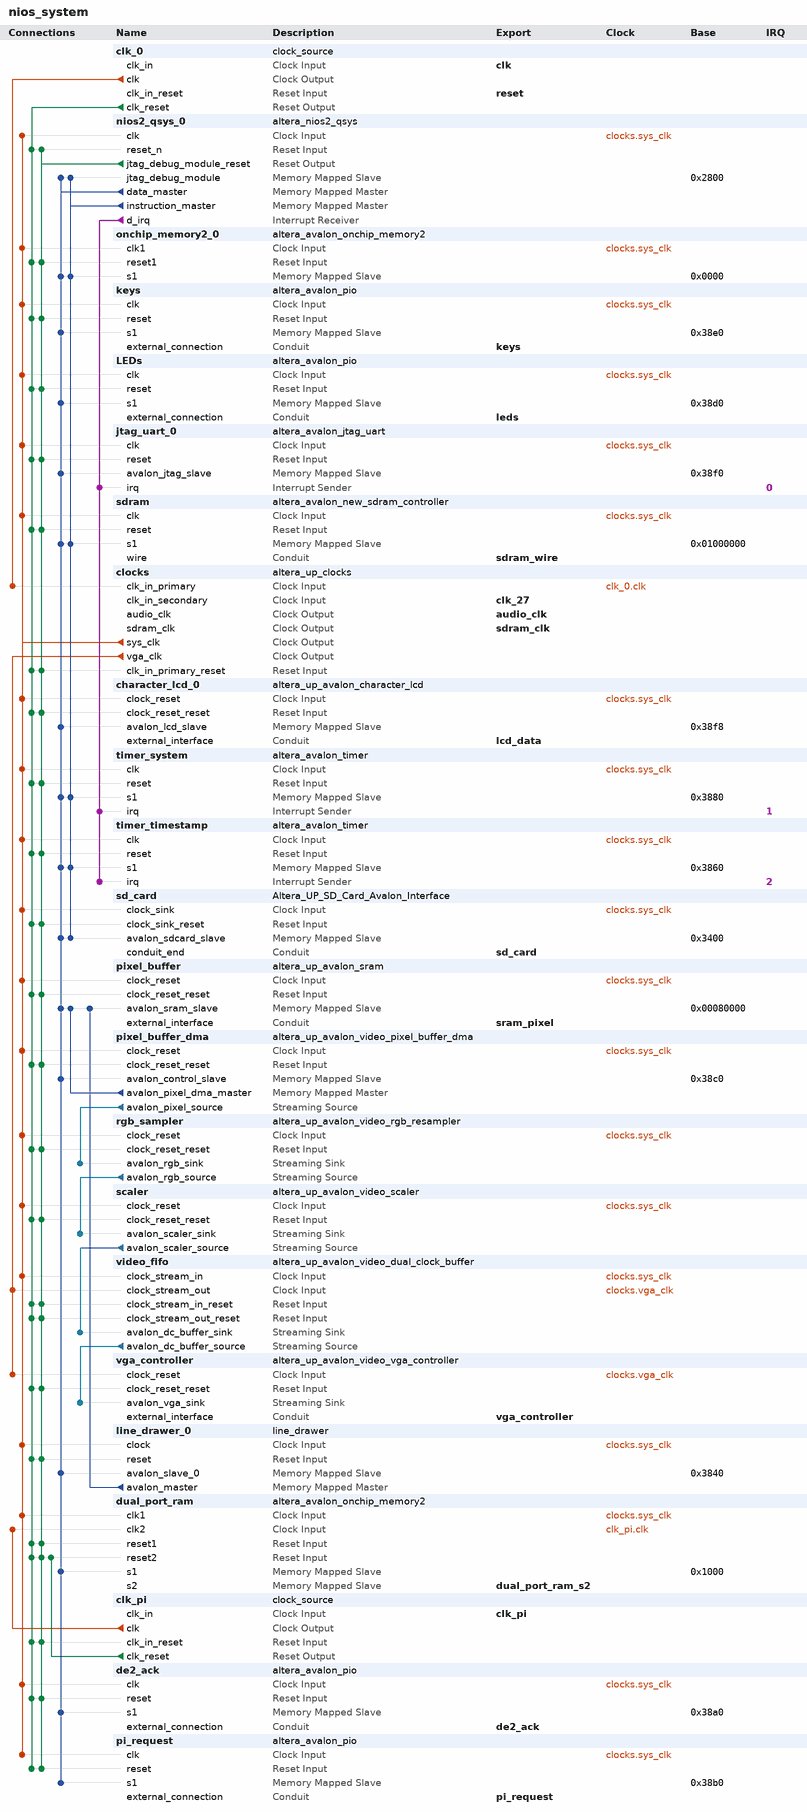
[diagram p0: system contents]
# Platform Designer (Qsys) system nios_system, Cyclone II EP2C35F672C6
# Parameters at their usual value, and those the tool derives, are not listed.
package require -exact qsys 13.0
create_system nios_system
set_project_property DEVICE_FAMILY {Cyclone II}
set_project_property DEVICE EP2C35F672C6

add_instance clk_0 clock_source 13.0
set_instance_parameter_value clk_0 clockFrequency 50000000

add_instance nios2_qsys_0 altera_nios2_qsys 13.0
set_instance_parameter_value nios2_qsys_0 muldiv_divider true
set_instance_parameter_value nios2_qsys_0 resetSlave sdram.s1
set_instance_parameter_value nios2_qsys_0 mmu_TLBMissExcSlave None
set_instance_parameter_value nios2_qsys_0 exceptionSlave sdram.s1
set_instance_parameter_value nios2_qsys_0 breakSlave nios2_qsys_0.jtag_debug_module
set_instance_parameter_value nios2_qsys_0 impl Tiny
set_instance_parameter_value nios2_qsys_0 icache_size 8192
set_instance_parameter_value nios2_qsys_0 dcache_bursts true
set_instance_parameter_value nios2_qsys_0 dcache_size 8192
set_instance_parameter_value nios2_qsys_0 dcache_lineSize 4

add_instance onchip_memory2_0 altera_avalon_onchip_memory2 13.0.1.99.2
set_instance_parameter_value onchip_memory2_0 dataWidth 32
set_instance_parameter_value onchip_memory2_0 dualPort false
set_instance_parameter_value onchip_memory2_0 initMemContent true
set_instance_parameter_value onchip_memory2_0 initializationFileName onchip_mem.hex
set_instance_parameter_value onchip_memory2_0 memorySize 4096

add_instance keys altera_avalon_pio 13.0.1.99.2
set_instance_parameter_value keys direction Input
set_instance_parameter_value keys width 4

add_instance LEDs altera_avalon_pio 13.0.1.99.2
set_instance_parameter_value LEDs direction Output
set_instance_parameter_value LEDs width 4

add_instance jtag_uart_0 altera_avalon_jtag_uart 13.0.1.99.2
set_instance_parameter_value jtag_uart_0 simInteractiveOptions NO_INTERACTIVE_WINDOWS

add_instance sdram altera_avalon_new_sdram_controller 13.0.1.99.2
set_instance_parameter_value sdram TAC 5.5
set_instance_parameter_value sdram TRCD 20.0
set_instance_parameter_value sdram TRP 20.0
set_instance_parameter_value sdram casLatency 3
set_instance_parameter_value sdram columnWidth 8
set_instance_parameter_value sdram dataWidth 16
set_instance_parameter_value sdram generateSimulationModel false
set_instance_parameter_value sdram model single_Micron_MT48LC4M32B2_7_chip
set_instance_parameter_value sdram numberOfBanks 4
set_instance_parameter_value sdram numberOfChipSelects 1
set_instance_parameter_value sdram powerUpDelay 100.0
set_instance_parameter_value sdram refreshPeriod 15.625
set_instance_parameter_value sdram rowWidth 12

add_instance clocks altera_up_clocks 13.0
set_instance_parameter_value clocks board DE2
set_instance_parameter_value clocks vga_clk true
set_instance_parameter_value clocks audio_clk true
set_instance_parameter_value clocks audio_clk_freq 12.288

add_instance character_lcd_0 altera_up_avalon_character_lcd 13.0
set_instance_parameter_value character_lcd_0 cursor Normal

add_instance timer_system altera_avalon_timer 13.0.1.99.2
set_instance_parameter_value timer_system period 1
set_instance_parameter_value timer_system periodUnits MSEC

add_instance timer_timestamp altera_avalon_timer 13.0.1.99.2
set_instance_parameter_value timer_timestamp period 1
set_instance_parameter_value timer_timestamp periodUnits MSEC

add_instance sd_card Altera_UP_SD_Card_Avalon_Interface 13.0

add_instance pixel_buffer altera_up_avalon_sram 13.0
set_instance_parameter_value pixel_buffer board DE2
set_instance_parameter_value pixel_buffer pixel_buffer true

add_instance pixel_buffer_dma altera_up_avalon_video_pixel_buffer_dma 13.0
set_instance_parameter_value pixel_buffer_dma addr_mode X-Y
set_instance_parameter_value pixel_buffer_dma start_address 0
set_instance_parameter_value pixel_buffer_dma back_start_address 0
set_instance_parameter_value pixel_buffer_dma image_width 320
set_instance_parameter_value pixel_buffer_dma image_height 240
set_instance_parameter_value pixel_buffer_dma color_space {16-bit RGB}

add_instance rgb_sampler altera_up_avalon_video_rgb_resampler 13.0
set_instance_parameter_value rgb_sampler input_type {16-bit RGB}
set_instance_parameter_value rgb_sampler output_type {30-bit RGB}
set_instance_parameter_value rgb_sampler alpha 1023

add_instance scaler altera_up_avalon_video_scaler 13.0
set_instance_parameter_value scaler width_scaling 2
set_instance_parameter_value scaler height_scaling 2
set_instance_parameter_value scaler width_in 320
set_instance_parameter_value scaler color_bits 10
set_instance_parameter_value scaler color_planes 3

add_instance video_fifo altera_up_avalon_video_dual_clock_buffer 13.0
set_instance_parameter_value video_fifo color_bits 10

add_instance vga_controller altera_up_avalon_video_vga_controller 13.0
set_instance_parameter_value vga_controller board DE2

add_instance line_drawer_0 line_drawer 1.0

add_instance dual_port_ram altera_avalon_onchip_memory2 13.0.1.99.2
set_instance_parameter_value dual_port_ram dataWidth 8
set_instance_parameter_value dual_port_ram dualPort true
set_instance_parameter_value dual_port_ram initMemContent true
set_instance_parameter_value dual_port_ram initializationFileName onchip_mem.hex
set_instance_parameter_value dual_port_ram memorySize 4096

add_instance clk_pi clock_source 13.0
set_instance_parameter_value clk_pi clockFrequency 50000000

add_instance de2_ack altera_avalon_pio 13.0.1.99.2
set_instance_parameter_value de2_ack direction Output
set_instance_parameter_value de2_ack width 1

add_instance pi_request altera_avalon_pio 13.0.1.99.2
set_instance_parameter_value pi_request direction Input
set_instance_parameter_value pi_request width 1

# connections
add_connection clk_0.clk clocks.clk_in_primary clock
add_connection clk_pi.clk dual_port_ram.clk2 clock
add_connection clocks.sys_clk character_lcd_0.clock_reset clock
add_connection clocks.sys_clk de2_ack.clk clock
add_connection clocks.sys_clk dual_port_ram.clk1 clock
add_connection clocks.sys_clk jtag_uart_0.clk clock
add_connection clocks.sys_clk keys.clk clock
add_connection clocks.sys_clk LEDs.clk clock
add_connection clocks.sys_clk line_drawer_0.clock clock
add_connection clocks.sys_clk nios2_qsys_0.clk clock
add_connection clocks.sys_clk onchip_memory2_0.clk1 clock
add_connection clocks.sys_clk pi_request.clk clock
add_connection clocks.sys_clk pixel_buffer.clock_reset clock
add_connection clocks.sys_clk pixel_buffer_dma.clock_reset clock
add_connection clocks.sys_clk rgb_sampler.clock_reset clock
add_connection clocks.sys_clk scaler.clock_reset clock
add_connection clocks.sys_clk sd_card.clock_sink clock
add_connection clocks.sys_clk sdram.clk clock
add_connection clocks.sys_clk timer_system.clk clock
add_connection clocks.sys_clk timer_timestamp.clk clock
add_connection clocks.sys_clk video_fifo.clock_stream_in clock
add_connection clocks.vga_clk vga_controller.clock_reset clock
add_connection clocks.vga_clk video_fifo.clock_stream_out clock
add_connection clk_0.clk_reset character_lcd_0.clock_reset_reset reset
add_connection clk_0.clk_reset clk_pi.clk_in_reset reset
add_connection clk_0.clk_reset clocks.clk_in_primary_reset reset
add_connection clk_0.clk_reset de2_ack.reset reset
add_connection clk_0.clk_reset dual_port_ram.reset1 reset
add_connection clk_0.clk_reset dual_port_ram.reset2 reset
add_connection clk_0.clk_reset jtag_uart_0.reset reset
add_connection clk_0.clk_reset keys.reset reset
add_connection clk_0.clk_reset LEDs.reset reset
add_connection clk_0.clk_reset line_drawer_0.reset reset
add_connection clk_0.clk_reset nios2_qsys_0.reset_n reset
add_connection clk_0.clk_reset onchip_memory2_0.reset1 reset
add_connection clk_0.clk_reset pi_request.reset reset
add_connection clk_0.clk_reset pixel_buffer.clock_reset_reset reset
add_connection clk_0.clk_reset pixel_buffer_dma.clock_reset_reset reset
add_connection clk_0.clk_reset rgb_sampler.clock_reset_reset reset
add_connection clk_0.clk_reset scaler.clock_reset_reset reset
add_connection clk_0.clk_reset sd_card.clock_sink_reset reset
add_connection clk_0.clk_reset sdram.reset reset
add_connection clk_0.clk_reset timer_system.reset reset
add_connection clk_0.clk_reset timer_timestamp.reset reset
add_connection clk_0.clk_reset vga_controller.clock_reset_reset reset
add_connection clk_0.clk_reset video_fifo.clock_stream_in_reset reset
add_connection clk_0.clk_reset video_fifo.clock_stream_out_reset reset
add_connection clk_pi.clk_reset dual_port_ram.reset2 reset
add_connection nios2_qsys_0.jtag_debug_module_reset character_lcd_0.clock_reset_reset reset
add_connection nios2_qsys_0.jtag_debug_module_reset clk_pi.clk_in_reset reset
add_connection nios2_qsys_0.jtag_debug_module_reset clocks.clk_in_primary_reset reset
add_connection nios2_qsys_0.jtag_debug_module_reset de2_ack.reset reset
add_connection nios2_qsys_0.jtag_debug_module_reset dual_port_ram.reset1 reset
add_connection nios2_qsys_0.jtag_debug_module_reset dual_port_ram.reset2 reset
add_connection nios2_qsys_0.jtag_debug_module_reset jtag_uart_0.reset reset
add_connection nios2_qsys_0.jtag_debug_module_reset keys.reset reset
add_connection nios2_qsys_0.jtag_debug_module_reset LEDs.reset reset
add_connection nios2_qsys_0.jtag_debug_module_reset line_drawer_0.reset reset
add_connection nios2_qsys_0.jtag_debug_module_reset nios2_qsys_0.reset_n reset
add_connection nios2_qsys_0.jtag_debug_module_reset onchip_memory2_0.reset1 reset
add_connection nios2_qsys_0.jtag_debug_module_reset pi_request.reset reset
add_connection nios2_qsys_0.jtag_debug_module_reset pixel_buffer.clock_reset_reset reset
add_connection nios2_qsys_0.jtag_debug_module_reset pixel_buffer_dma.clock_reset_reset reset
add_connection nios2_qsys_0.jtag_debug_module_reset rgb_sampler.clock_reset_reset reset
add_connection nios2_qsys_0.jtag_debug_module_reset scaler.clock_reset_reset reset
add_connection nios2_qsys_0.jtag_debug_module_reset sd_card.clock_sink_reset reset
add_connection nios2_qsys_0.jtag_debug_module_reset sdram.reset reset
add_connection nios2_qsys_0.jtag_debug_module_reset timer_system.reset reset
add_connection nios2_qsys_0.jtag_debug_module_reset timer_timestamp.reset reset
add_connection nios2_qsys_0.jtag_debug_module_reset vga_controller.clock_reset_reset reset
add_connection nios2_qsys_0.jtag_debug_module_reset video_fifo.clock_stream_in_reset reset
add_connection nios2_qsys_0.jtag_debug_module_reset video_fifo.clock_stream_out_reset reset
add_connection line_drawer_0.avalon_master pixel_buffer.avalon_sram_slave avalon
set_connection_parameter_value line_drawer_0.avalon_master/pixel_buffer.avalon_sram_slave baseAddress 0x00080000
add_connection nios2_qsys_0.data_master character_lcd_0.avalon_lcd_slave avalon
set_connection_parameter_value nios2_qsys_0.data_master/character_lcd_0.avalon_lcd_slave baseAddress 0x38f8
add_connection nios2_qsys_0.data_master de2_ack.s1 avalon
set_connection_parameter_value nios2_qsys_0.data_master/de2_ack.s1 baseAddress 0x38a0
add_connection nios2_qsys_0.data_master dual_port_ram.s1 avalon
set_connection_parameter_value nios2_qsys_0.data_master/dual_port_ram.s1 baseAddress 0x1000
add_connection nios2_qsys_0.data_master jtag_uart_0.avalon_jtag_slave avalon
set_connection_parameter_value nios2_qsys_0.data_master/jtag_uart_0.avalon_jtag_slave baseAddress 0x38f0
add_connection nios2_qsys_0.data_master keys.s1 avalon
set_connection_parameter_value nios2_qsys_0.data_master/keys.s1 baseAddress 0x38e0
add_connection nios2_qsys_0.data_master LEDs.s1 avalon
set_connection_parameter_value nios2_qsys_0.data_master/LEDs.s1 baseAddress 0x38d0
add_connection nios2_qsys_0.data_master line_drawer_0.avalon_slave_0 avalon
set_connection_parameter_value nios2_qsys_0.data_master/line_drawer_0.avalon_slave_0 baseAddress 0x3840
add_connection nios2_qsys_0.data_master nios2_qsys_0.jtag_debug_module avalon
set_connection_parameter_value nios2_qsys_0.data_master/nios2_qsys_0.jtag_debug_module baseAddress 0x2800
add_connection nios2_qsys_0.data_master onchip_memory2_0.s1 avalon
set_connection_parameter_value nios2_qsys_0.data_master/onchip_memory2_0.s1 baseAddress 0x0000
add_connection nios2_qsys_0.data_master pi_request.s1 avalon
set_connection_parameter_value nios2_qsys_0.data_master/pi_request.s1 baseAddress 0x38b0
add_connection nios2_qsys_0.data_master pixel_buffer.avalon_sram_slave avalon
set_connection_parameter_value nios2_qsys_0.data_master/pixel_buffer.avalon_sram_slave baseAddress 0x00080000
add_connection nios2_qsys_0.data_master pixel_buffer_dma.avalon_control_slave avalon
set_connection_parameter_value nios2_qsys_0.data_master/pixel_buffer_dma.avalon_control_slave baseAddress 0x38c0
add_connection nios2_qsys_0.data_master sd_card.avalon_sdcard_slave avalon
set_connection_parameter_value nios2_qsys_0.data_master/sd_card.avalon_sdcard_slave baseAddress 0x3400
add_connection nios2_qsys_0.data_master sdram.s1 avalon
set_connection_parameter_value nios2_qsys_0.data_master/sdram.s1 baseAddress 0x01000000
add_connection nios2_qsys_0.data_master timer_system.s1 avalon
set_connection_parameter_value nios2_qsys_0.data_master/timer_system.s1 baseAddress 0x3880
add_connection nios2_qsys_0.data_master timer_timestamp.s1 avalon
set_connection_parameter_value nios2_qsys_0.data_master/timer_timestamp.s1 baseAddress 0x3860
add_connection nios2_qsys_0.instruction_master nios2_qsys_0.jtag_debug_module avalon
set_connection_parameter_value nios2_qsys_0.instruction_master/nios2_qsys_0.jtag_debug_module baseAddress 0x2800
add_connection nios2_qsys_0.instruction_master onchip_memory2_0.s1 avalon
set_connection_parameter_value nios2_qsys_0.instruction_master/onchip_memory2_0.s1 baseAddress 0x0000
add_connection nios2_qsys_0.instruction_master sd_card.avalon_sdcard_slave avalon
set_connection_parameter_value nios2_qsys_0.instruction_master/sd_card.avalon_sdcard_slave baseAddress 0x3400
add_connection nios2_qsys_0.instruction_master sdram.s1 avalon
set_connection_parameter_value nios2_qsys_0.instruction_master/sdram.s1 baseAddress 0x01000000
add_connection nios2_qsys_0.instruction_master timer_system.s1 avalon
set_connection_parameter_value nios2_qsys_0.instruction_master/timer_system.s1 baseAddress 0x3880
add_connection nios2_qsys_0.instruction_master timer_timestamp.s1 avalon
set_connection_parameter_value nios2_qsys_0.instruction_master/timer_timestamp.s1 baseAddress 0x3860
add_connection pixel_buffer_dma.avalon_pixel_dma_master pixel_buffer.avalon_sram_slave avalon
set_connection_parameter_value pixel_buffer_dma.avalon_pixel_dma_master/pixel_buffer.avalon_sram_slave baseAddress 0x00080000
add_connection pixel_buffer_dma.avalon_pixel_source rgb_sampler.avalon_rgb_sink avalon_streaming
add_connection rgb_sampler.avalon_rgb_source scaler.avalon_scaler_sink avalon_streaming
add_connection scaler.avalon_scaler_source video_fifo.avalon_dc_buffer_sink avalon_streaming
add_connection video_fifo.avalon_dc_buffer_source vga_controller.avalon_vga_sink avalon_streaming
add_connection nios2_qsys_0.d_irq jtag_uart_0.irq interrupt
set_connection_parameter_value nios2_qsys_0.d_irq/jtag_uart_0.irq irqNumber 0
add_connection nios2_qsys_0.d_irq timer_system.irq interrupt
set_connection_parameter_value nios2_qsys_0.d_irq/timer_system.irq irqNumber 1
add_connection nios2_qsys_0.d_irq timer_timestamp.irq interrupt
set_connection_parameter_value nios2_qsys_0.d_irq/timer_timestamp.irq irqNumber 2

# exported interfaces
add_interface clk clock sink
set_interface_property clk EXPORT_OF clk_0.clk_in
add_interface keys conduit end
set_interface_property keys EXPORT_OF keys.external_connection
add_interface leds conduit end
set_interface_property leds EXPORT_OF LEDs.external_connection
add_interface reset reset sink
set_interface_property reset EXPORT_OF clk_0.clk_in_reset
add_interface sdram_wire conduit end
set_interface_property sdram_wire EXPORT_OF sdram.wire
add_interface sdram_clk clock source
set_interface_property sdram_clk EXPORT_OF clocks.sdram_clk
add_interface lcd_data conduit end
set_interface_property lcd_data EXPORT_OF character_lcd_0.external_interface
add_interface sd_card conduit end
set_interface_property sd_card EXPORT_OF sd_card.conduit_end
add_interface audio_clk clock source
set_interface_property audio_clk EXPORT_OF clocks.audio_clk
add_interface clk_27 clock sink
set_interface_property clk_27 EXPORT_OF clocks.clk_in_secondary
add_interface sram_pixel conduit end
set_interface_property sram_pixel EXPORT_OF pixel_buffer.external_interface
add_interface vga_controller conduit end
set_interface_property vga_controller EXPORT_OF vga_controller.external_interface
add_interface dual_port_ram_s2 avalon slave
set_interface_property dual_port_ram_s2 EXPORT_OF dual_port_ram.s2
add_interface clk_pi clock sink
set_interface_property clk_pi EXPORT_OF clk_pi.clk_in
add_interface de2_ack conduit end
set_interface_property de2_ack EXPORT_OF de2_ack.external_connection
add_interface pi_request conduit end
set_interface_property pi_request EXPORT_OF pi_request.external_connection

set_interconnect_requirement {$system} qsys_mm.clockCrossingAdapter HANDSHAKE
set_interconnect_requirement {$system} qsys_mm.maxAdditionalLatency 1

save_system nios_system.qsys
